# Altium project TX_Board.PrjPcb (part 1 of 5)
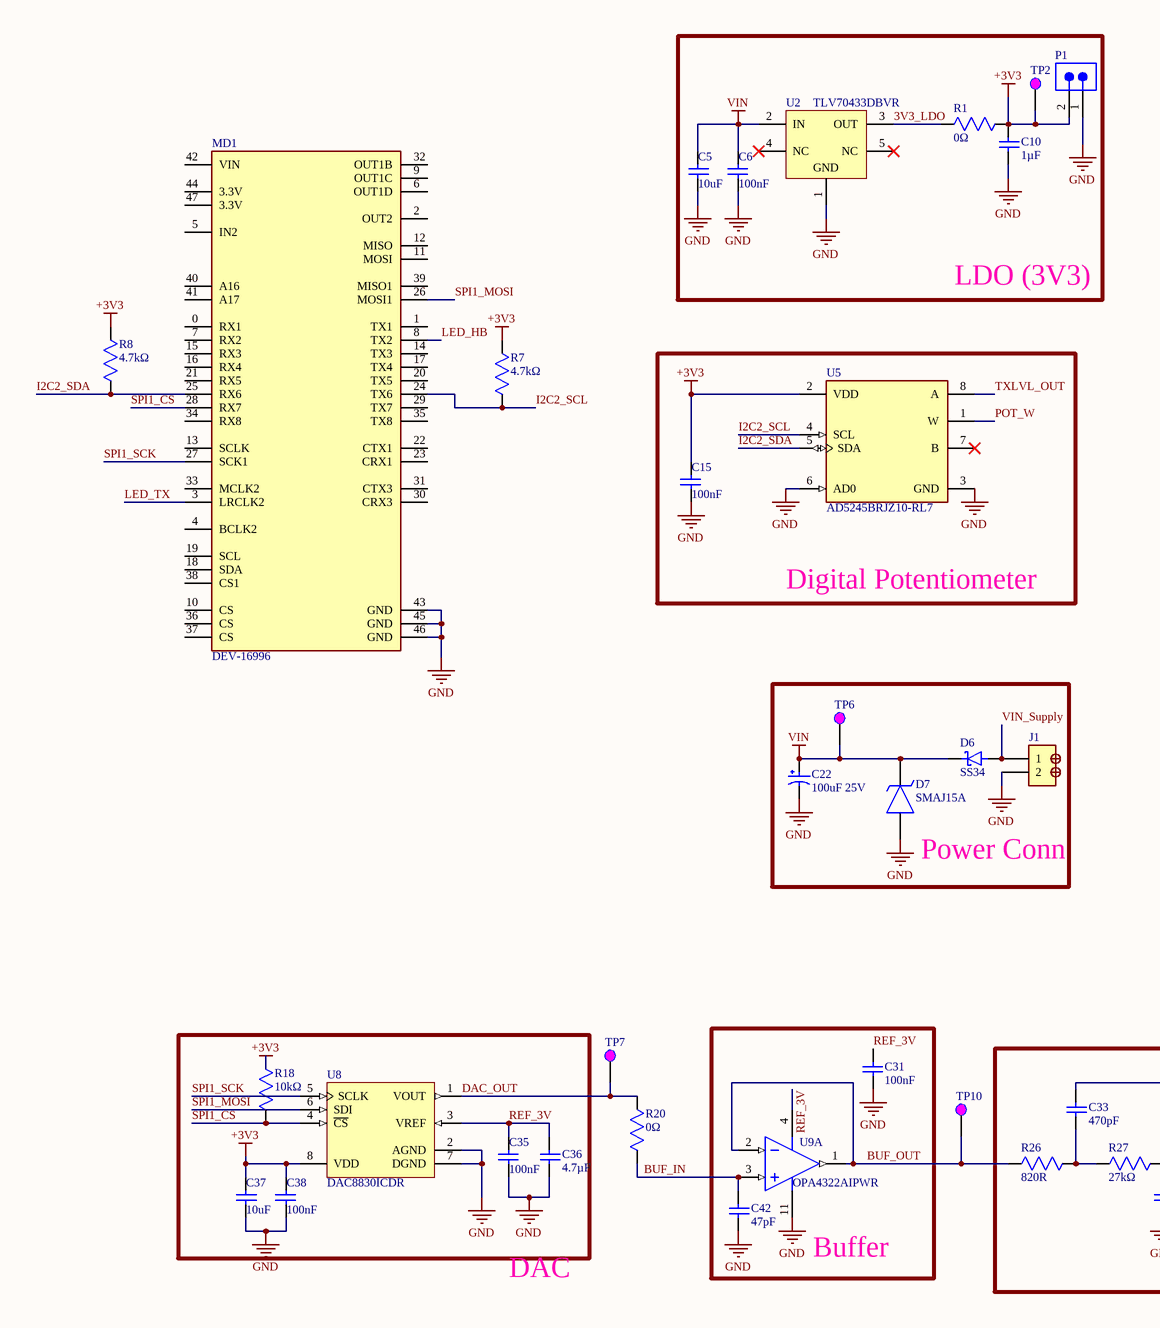
[diagram p0: TX_Board.SchDoc, left]
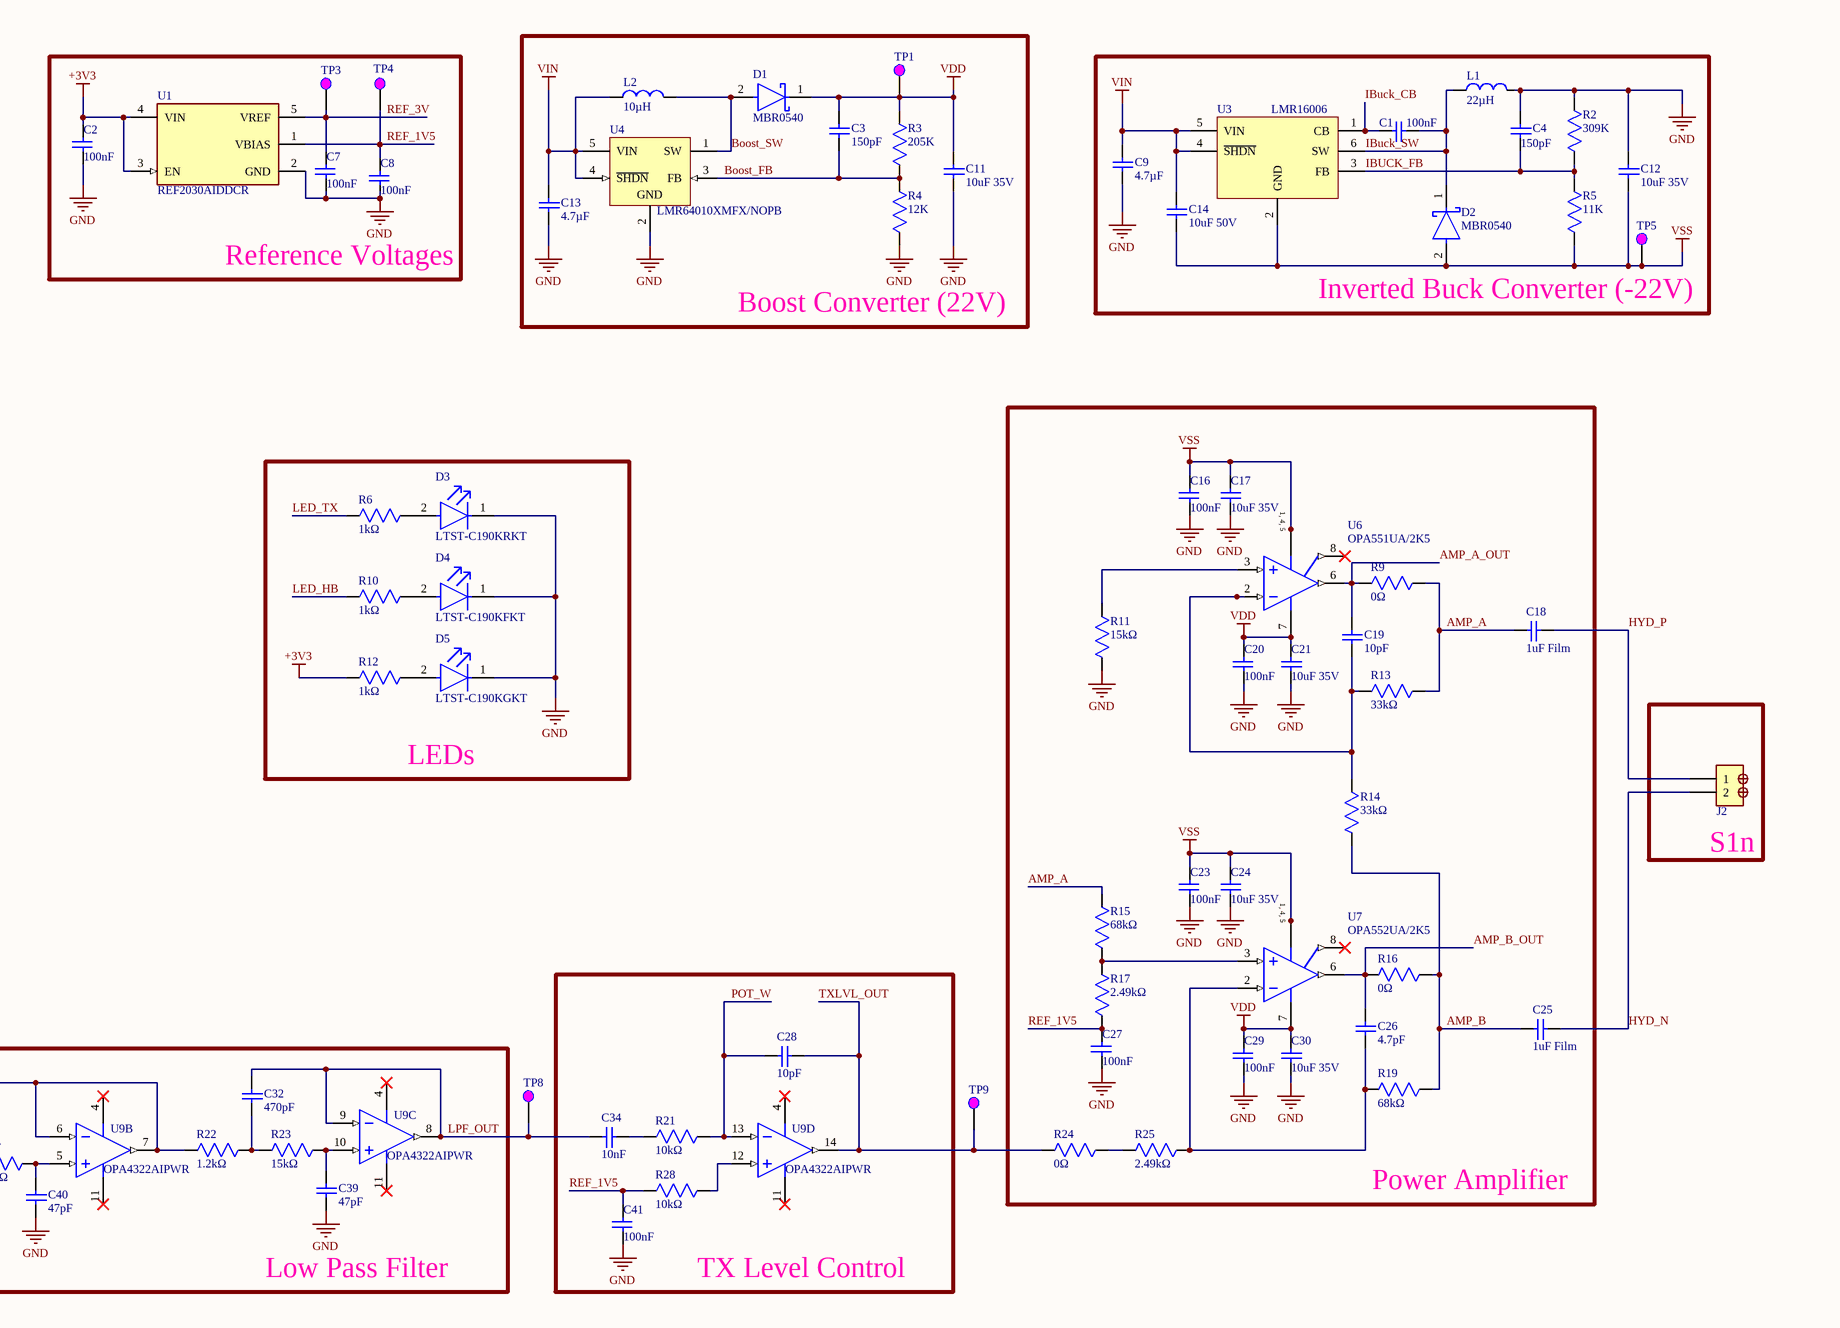
[diagram p1: TX_Board.SchDoc, right]
1 sheet, 102 parts. Net scope: global (net labels, ports and power ports of the same name join across sheets).
Board file: TX_Board.PcbDoc

## Sheet TX_Board.SchDoc
size A2; SheetNumber: 1; SheetTotal: 1

### Parts
C1  100nF  [CAP_0603]
C2  100nF  [CAP_0603]
C3  150pF  [CAP_0603]
C4  150pF  [CAP_0603]
C5  10uF  [CAP_0603]
C6  100nF  [CAP_0603]
C7  100nF  [CAP_0603]
C8  100nF  [CAP_0603]
C9  4.7µF  [CAP_0603]
C10  1µF  [CAP_0603]
C11  10uF 35V  [CAP_0603]
C12  10uF 35V  [CAP_0603]
C13  4.7µF  [CAP_0603]
C14  10uF 50V  [CAP_0603]
C15  100nF  [CAP_0603]
C16  100nF  [CAP_0603]
C17  10uF 35V  [CAP_0603]
C18  1uF Film  [PE105J2A0502]
C19  10pF  [CAP_0603]
C20  100nF  [CAP_0603]
C21  10uF 35V  [CAP_0603]
C22  100uF 25V  [CAPAE660X800N]
C23  100nF  [CAP_0603]
C24  10uF 35V  [CAP_0603]
C25  1uF Film  [PE105J2A0502]
C26  4.7pF  [CAP_0603]
C27  100nF  [CAP_0603]
C28  10pF  [CAP_0603]
C29  100nF  [CAP_0603]
C30  10uF 35V  [CAP_0603]
C31  100nF  [CAP_0603]
C32  470pF  [CAP_0603]
C33  470pF  [CAP_0603]
C34  10nF  [CAP_0603]
C35  100nF  [CAP_0603]
C36  4.7µF  [CAP_0603]
C37  10uF  [CAP_0603]
C38  100nF  [CAP_0603]
C39  47pF  [CAP_0603]
C40  47pF  [CAP_0603]
C41  100nF  [CAP_0603]
C42  47pF  [CAP_0603]
D1  MBR0540  [FP-425-04-MFG]
D2  MBR0540  [FP-425-04-MFG]
D3  LTST-C190KRKT  [FP-LTST-C190KRKT-MFG]
D4  LTST-C190KFKT  [FP-LTST-C190KFKT-MFG]
D5  LTST-C190KGKT  [FP-LTST-C190KGKT-MFG]
D6  SS34  [SS34]
D7  SMAJ15A  [DIOM5026X229N]
J1  DB301V-3.5-2P-GN-S  [DB301V-3.5-2P-GN-S]  (value not drawn)
J2  DB301V-3.5-2P-GN-S  [DB301V-3.5-2P-GN-S]  (value not drawn)
L1  22µH  [SWPA5040S100MT]
L2  10µH  [SWPA5040S100MT]
MD1  DEV-16996  [FP-DEV-16996-MFG]
P1  61300211121  [61300211121]  (value not drawn)
R1  0Ω  [RES_0603]
R2  309K  [RES_0603]
R3  205K  [RES_0603]
R4  12K  [RES_0603]
R5  11K  [RES_0603]
R6  1kΩ  [RES_0603]
R7  4.7kΩ  [RES_0603]
R8  4.7kΩ  [RES_0603]
R9  0Ω  [RES_0603]
R10  1kΩ  [RES_0603]
R11  15kΩ  [RES_0603]
R12  1kΩ  [RES_0603]
R13  33kΩ  [RES_0603]
R14  33kΩ  [RES_0603]
R15  68kΩ  [RES_0603]
R16  0Ω  [RES_0603]
R17  2.49kΩ  [RES_0603]
R18  10kΩ  [CAP_0603]
R19  68kΩ  [RES_0603]
R20  0Ω  [RES_0603]
R21  10kΩ  [CAP_0603]
R22  1.2kΩ  [RES_0603]
R23  15kΩ  [RES_0603]
R24  0Ω  [RES_0603]
R25  2.49kΩ  [RES_0603]
R26  820R  [RES_0603]
R27  27kΩ  [RES_0603]
R28  10kΩ  [CAP_0603]
TP1  Test Point  [Test Point]  (value not drawn)
TP2  Test Point  [Test Point]  (value not drawn)
TP3  Test Point  [Test Point]  (value not drawn)
TP4  Test Point  [Test Point]  (value not drawn)
TP5  Test Point  [Test Point]  (value not drawn)
TP6  Test Point  [Test Point]  (value not drawn)
TP7  Test Point  [Test Point]  (value not drawn)
TP8  Test Point  [Test Point]  (value not drawn)
TP9  Test Point  [Test Point]  (value not drawn)
TP10  Test Point  [Test Point]  (value not drawn)
U1  REF2030AIDDCR  [FP-DDC0005A-IPC_A]
U2  TLV70433DBVR  [DBV0005A_M]
U3  LMR16006  [LMR16006YDDCR]
U4  LMR64010XMFX/NOPB  [DBV0005A_N]
U5  AD5245BRJZ10-RL7  [FP-RJ-8-IPC_B]
U6  OPA551UA/2K5  [D0008A_N]
U7  OPA552UA/2K5  [D0008A_N]
U8  DAC8830ICDR  [TI-D8_M]
U9  OPA4322AIPWR  [PW0014A_N]  (parts A,B,C,D of 4)

### Blocks framed on the sheet
LDO (3V3): C5 C6 C10 P1 R1 TP2 U2
Reference Voltages: C2 C7 C8 TP3 TP4 U1
Boost Converter (22V): C3 C11 C13 D1 L2 R3 R4 TP1 U4
Inverted Buck Converter (-22V): C1 C4 C9 C12 C14 D2 L1 R2 R5 TP5 U3
Digital Potentiometer: C15 U5
Power Amplifier: C16-C21 C23-C27 C29 C30 R9 R11 R13-R17 R19 R24 R25 U6 U7
LEDs: D3-D5 R6 R10 R12
Power Conn: C22 D6 D7 J1 TP6
S1n: J2
TX Level Control: C28 C34 C41 R21 R28 U9
Buffer: C31 C42 U9
Low Pass Filter: C32 C33 C39 C40 R22 R23 R26 R27 U9

### Nets
+3V3: C2.1 C10.2 C15.1 C37.2 C38.1 P1.2 R1.2 R7.2 R8.2 R12.1 R18.2 TP2.1 U1.3(EN) U1.4(VIN) U5.2(VDD) U8.8(VDD)
GND: C2.2 C4.2 C5.1 C6.2 C7.2 C8.2 C9.1 C10.1 C11.1 C12.2 C13.1 C15.2 C16.2 C17.1 C20.2 C21.1 C22.2(-) C23.2 C24.1 C27.2 C29.2 C30.1 C31.2 C35.2 C36.1 C37.1 C38.2 C39.1 C40.1 C41.2 C42.1 D3.1(C) D4.1(C) D5.1(C) D7.2(A) J1.2 L1.2 MD1.43(GND) MD1.45(GND) MD1.46(GND) P1.1 R2.2 R4.1 R11.1 U1.2(GND) U2.1(GND) U4.2(GND) U5.3(GND) U5.6(AD0) U8.2(AGND) U8.7(DGND) U9.11(V-)
VDD: C3.2 C11.2 C20.1 C21.2 C29.1 C30.2 D1.1(C) R3.2 TP1.1 U6.7(V+) U7.7(V+)
VIN: C5.2 C6.1 C9.2 C13.2 C14.2 C22.1(+) D6.K D7.1(K) L2.1 TP6.1 U2.2(IN) U3.4(~{SHDN}) U3.5(VIN) U4.4(~{SHDN}) U4.5(VIN)
VSS: C12.1 C14.1 C16.1 C17.2 C23.1 C24.2 D2.2(A) R5.1 TP5.1 U3.2(GND) U6.1(V-) U6.4(V-) U6.5(V-) U7.1(V-) U7.4(V-) U7.5(V-)
3V3_LDO: R1.1 U2.3(OUT)
AMP_A: C18.1 R9.2 R13.1 R15.2
AMP_A_OUT: C19.2 R9.1 U6.6(OUT)
AMP_B: C25.1 R14.1 R16.2 R19.2
AMP_B_OUT: C26.2 R16.1 U7.6(OUT)
Boost_FB: C3.1 R3.1 R4.2 U4.3(FB)
Boost_SW: D1.2(A) L2.2 U4.1(SW)
BUF_IN: C42.2 R20.2 U9.3(IN_A+)
BUF_OUT: R26.1 TP10.1 U9.1(OUT_A) U9.2(IN_A-)
DAC_OUT: R20.1 TP7.1 U8.1(VOUT)
HYD_N: C25.2 J2.2
HYD_P: C18.2 J2.1
I2C2_SCL: MD1.24(TX6) R7.1 U5.4(SCL)
I2C2_SDA: MD1.25(RX6) R8.1 U5.5(SDA)
IBuck_CB: C1.1 U3.1(CB)
IBUCK_FB: C4.1 R2.1 R5.2 U3.3(FB)
IBuck_SW: C1.2 D2.1(C) L1.1 U3.6(SW)
LED_HB: MD1.8(TX2) R10.1
LED_TX: MD1.3(LRCLK2) R6.1
LPF_OUT: C32.2 C34.1 TP8.1 U9.8(OUT_C) U9.9(IN_C-)
POT_W: C28.1 R21.2 U5.1(W) U9.13(IN_D-)
REF_1V5: C8.1 C27.1 C41.1 R17.1 R28.1 TP4.1 U1.1(VBIAS)
REF_3V: C7.1 C31.1 C35.1 C36.2 TP3.1 U1.5(VREF) U8.3(VREF) U9.4(V+)
SPI1_CS: MD1.28(RX7) R18.1 U8.4(~{CS})
SPI1_MOSI: MD1.26(MOSI1) U8.6(SDI)
SPI1_SCK: MD1.27(SCK1) U8.5(SCLK)
TXLVL_OUT: C28.2 R24.1 TP9.1 U5.8(A) U9.14(OUT_D)
VIN_Supply: D6.A J1.1
NetC19_1: C19.1 R13.2 R14.2 U6.2(IN-)
NetC26_1: C26.1 R19.1 R25.2 U7.2(IN-)
NetC32_1: C32.1 R22.2 R23.1
NetC33_1: C33.1 R26.2 R27.1
NetC33_2: C33.2 R22.1 U9.6(IN_B-) U9.7(OUT_B)
NetC34_2: C34.2 R21.1
NetC39_2: C39.2 R23.2 U9.10(IN_C+)
NetC40_2: C40.2 R27.2 U9.5(IN_B+)
NetD3_2: D3.2(A) R6.2
NetD4_2: D4.2(A) R10.2
NetD5_2: D5.2(A) R12.2
NetR11_2: R11.2 U6.3(IN+)
NetR15_1: R15.1 R17.2 U7.3(IN+)
NetR24_2: R24.2 R25.1
NetR28_2: R28.2 U9.12(IN_D+)

Not connected (* = marked no-connect by the designer): MD1 0(RX1) 1(TX1) 2(OUT2) 4(BCLK2) 5(IN2) 6(OUT1D) 7(RX2) 9(OUT1C) 10(CS) 11(MOSI) 12(MISO) 13(SCLK) 14(TX3) 15(RX3) 16(RX4) 17(TX4) 18(SDA) 19(SCL) 20(TX5) 21(RX5) 22(CTX1) 23(CRX1) 29(TX7) 30(CRX3) 31(CTX3) 32(OUT1B) 33(MCLK2) 34(RX8) 35(TX8) 36(CS) 37(CS) 38(CS1) 39(MISO1) 40(A16) 41(A17) 42(VIN) 44(3.3V) 47(3.3V); U2 4(NC)* 5(NC)*; U5 7(B)*; U6 8(FLAG)*; U7 8(FLAG)*

### Notes on the sheet
- DAC
- (in symbol CMP-0272-03257-3) 1, 4, 5
- (in symbol CMP-0272-03266-3) 1, 4, 5